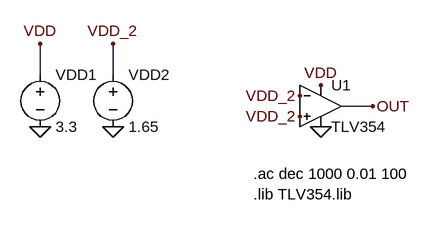
[diagram p0: schematic Draft1.asc]
Draft1.asc, the LTspice schematic file:
Version 4
SHEET 1 880 680
WIRE -64 64 -64 16
WIRE 48 64 48 16
WIRE 448 112 400 112
FLAG -64 144 0
FLAG -64 16 VDD
FLAG 48 144 0
FLAG 48 16 VDD_2
FLAG 368 80 VDD
FLAG 336 96 VDD_2
FLAG 336 128 VDD_2
FLAG 368 144 0
FLAG 448 112 OUT
SYMBOL Opamps\\opamp2 368 48 R0
SYMATTR InstName U1
SYMATTR Value TLV354
SYMBOL voltage -64 48 R0
WINDOW 123 0 0 Left 0
WINDOW 39 0 0 Left 0
SYMATTR InstName VDD1
SYMATTR Value 3.3
SYMBOL voltage 48 48 R0
WINDOW 123 0 0 Left 0
WINDOW 39 0 0 Left 0
SYMATTR InstName VDD2
SYMATTR Value 1.65
TEXT 264 216 Left 2 !.ac dec 1000 0.01 100
TEXT 264 248 Left 2 !.lib TLV354.lib

The netlist it stands for:
* Draft1.asc
XU1 VDD_2 VDD_2 VDD 0 OUT TLV354  ; pins In+ In- V+ V- OUT
VDD1 VDD 0 3.3
VDD2 VDD_2 0 1.65
.ac dec 1000 0.01 100
.lib TLV354.lib
.backanno
.end

* Results of the author's LTspice run, read from the files saved beside the schematic
* Operating Point, zero values left out:
*   V(out) = 3.2 V
*   V(vdd) = 3.3 V
*   V(vdd_2) = 1.65 V
*   I(Vdd1) = -5.2 mA
*   I(Vdd2) = -5.457 pA
*   Ix(u1:IN+) = 3.109 pA
*   Ix(u1:IN-) = 1.998 pA
*   Ix(u1:VCC) = 5.2 mA
*   Ix(u1:VEE) = -5.2 mA